# Altium schematic sheet schematic.SchDoc
size A2; SheetNumber: 1; SheetTotal: 1
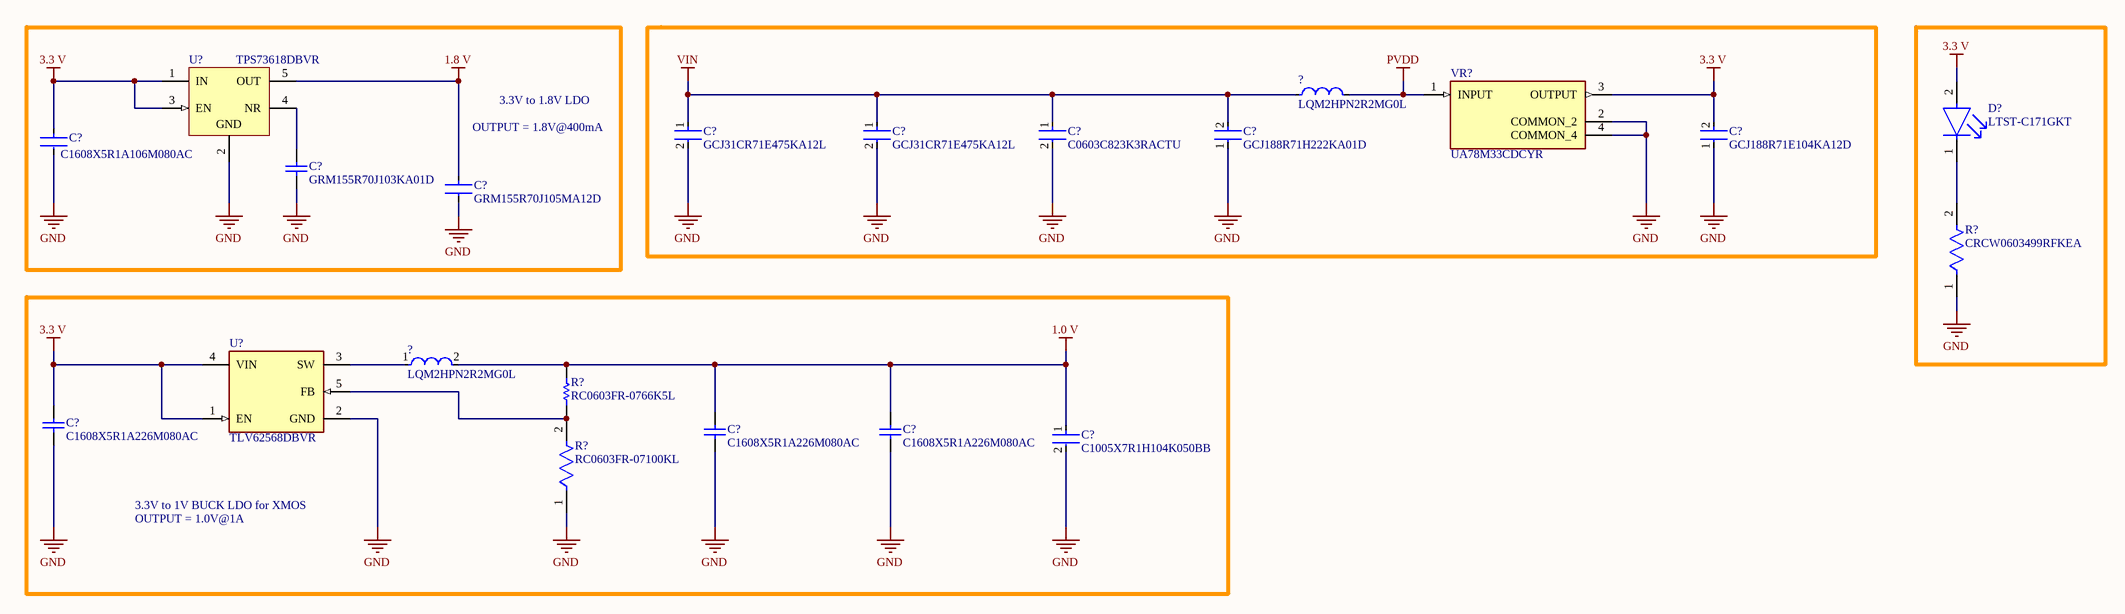
[diagram p0: schematic.SchDoc]

## Parts
(Parts that share a designator on the sheet are numbered #1, #2 ... from top to bottom, then left to right.)
?#1  LQM2HPN2R2MG0L  [FP-LQM2HPN_G0-IPC_B]
?#2  LQM2HPN2R2MG0L  [FP-LQM2HPN_G0-IPC_C]
C?#1  GCJ31CR71E475KA12L  [FP-GCJ31C-0_3-IPC_A]
C?#2  GCJ31CR71E475KA12L  [FP-GCJ31C-0_3-IPC_A]
C?#3  C0603C823K3RACTU  [FP-C0603C-CF-MFG]
C?#4  GCJ188R71H222KA01D  [FP-GCJ188-0_2-IPC_A]
C?#5  GCJ188R71E104KA12D  [FP-GCJ188-0_2-MFG]
C?#6  C1608X5R1A106M080AC  [FP-C1608-080-0_1-IPC_A]
C?#7  GRM155R70J103KA01D  [CAPC1005X55X25ML05T10]
C?#8  GRM155R70J105MA12D  [FP-GRM155-0_05-IPC_C]
C?#9  C1005X7R1H104K050BB  [FP-C1005-050-0_05-IPC_C]
C?#10  C1608X5R1A226M080AC  [CAPC1608X100X20ML10]
C?#11  C1608X5R1A226M080AC  [CAPC1608X100X20ML10]
C?#12  C1608X5R1A226M080AC  [CAPC1608X100X20ML10]
D?  LTST-C171GKT  [FP-LTST-C171GKT-MFG]
R?#1  CRCW0603499RFKEA  [FP-CRCW0603-e3-MFG]
R?#2  RC0603FR-0766K5L  [RESC1608X55X25ML10T15]
R?#3  RC0603FR-07100KL  [FP-RC0603-0_55-MFG]
U?#1  TPS73618DBVR  [DBV0005A_L]
U?#2  TLV62568DBVR  [FP-DBV0005A-MFG]
VR?  UA78M33CDCYR  [VREG_UA78M33CDCYR]

## Nets
1.0 V: ?#2.2 C?#9.1 C?#11.2 C?#12.2 R?#2.2
1.8 V: C?#8.1 U?#1.5(OUT)
3.3 V: C?#5.2 C?#6.2 C?#10.2 D?.2(A) U?#1.1(IN) U?#1.3(EN) U?#2.1(EN) U?#2.4(VIN) VR?.3(OUTPUT)
GND: C?#1.2 C?#2.2 C?#3.2 C?#4.1 C?#5.1 C?#6.1 C?#7.2 C?#8.2 C?#9.2 C?#10.1 C?#11.1 C?#12.1 R?#1.1 R?#3.1 U?#1.2(GND) U?#2.2(GND) VR?.2(COMMON_2) VR?.4(COMMON_4)
PVDD: ?#1.2 VR?.1(INPUT)
VIN: ?#1.1 C?#1.1 C?#2.1 C?#3.1 C?#4.2
Net?#2_1: ?#2.1 U?#2.3(SW)
NetC?#7_1: C?#7.1 U?#1.4(NR)
NetD?_1: D?.1(C) R?#1.2
NetR?#2_1: R?#2.1 R?#3.2 U?#2.5(FB)

## Notes on the sheet
- 3.3V to 1.8V LDO
- (near C?#8) OUTPUT = 1.8V@400mA
- 3.3V to 1V BUCK LDO for XMOS
- OUTPUT = 1.0V@1A

## Library data of the parts
?#1 ?#2 = CMP-1662-00028-2: Multilayer Type Inductor for Power Lines, 1008 (2520), 2.2μH, 20%, 0.1Ω, 1.3A; Core Material: Ferrite; DC Resistance (DCR): 100mR; Inductance: 2.2uH; Test Frequency: 1MHz; Self Resonant Frequency: 40MHz; Shielding: Shielded; Depth: 2.2mm; Length: 2.5mm; Max DC Current: 1.3A; Military Standard: Not; Current Rating: 1.3A; Termination: SMD/SMT; Radiation Hardening: No; Tolerance: 20%; Height: 1.2mm; Case Code (Metric): 2520; DC Current: 1.3A; Inductance Tolerance: 20%; Packaging: Tape and Reel; Width: 2mm; REACH SVHC: No SVHC; Mount: Surface Mount; Max Operating Temperature: 125°C; Lead Free: Lead Free; Case/Package: 1008; Case Code (Imperial): 1008; Series: LQM2HP_G0; Height - Seated (Max): 0.039inch; Package Quantity: 3000; Min Operating Temperature: -55°C
C?#1 C?#2 = CMP-06035-047309-1: Cap Ceramic 4.7uF 25V X7R 10% Pad SMD 1206 Soft Termination  +125°C Automotive T/R; Max Operating Temperature: 125°C; Mount: Surface Mount; Capacitance: 4.7uF; Features: Soft Termination; Thickness: 0.075inch; Dielectric: X7R; Tolerance: 10%; Termination: SMD/SMT; Ratings: AEC-Q200; Length: 0.126inch; Case Code (Imperial): 1206; Voltage Rating (DC): 25V; Lead Free: Lead Free; Case Code (Metric): 3216; Package Quantity: 2000; Min Operating Temperature: -55°C; Case/Package: 1206; Width: 0.063inch; Voltage Rating: 25V; Packaging: Tape and Reel; Depth: 1.6mm
C?#3 = CMP-2006-03280-2: CAP CER 0.082UF 25V 10% X7R 0603; Manufacturer: KEMET; Automotive Grade: Grade 1; Capacitance: 82,000 pF; Value: 82,000 pF; Material: Ceramic; Tolerance: 0.1; Description: C0603 82,000 pF X7R 30ppm/°C 10.00% 25 V; Temperature Coefficient: 30ppm/°C; Voltage Rating: 25 V; Digikey Description: CAP CER 0.082UF 25V 10% X7R 0603; Category: Cap; Device Class L2: Capacitors; Mouser Description: Multilayer Ceramic Capacitors MLCC - SMD/SMT 25volts 82000pF X7R 10%; Device Class L3: Ceramic Capacitors; Octopart: https://octopart.com/c0603c823k3ractu-kemet-9142851; ComponentLink2URL: https://api.kemet.com/component-edge/download/datasheet/C0603C100J5GACAUTO.pdf; Package: C0603C-CF; Temperature Characteristic: X7R; ComponentLink2Description: Datasheet; Lead Free: Yes; Automotive: Yes; Manufacturer Part Number: C0603C823K3RACTU; Temperature Range Low: -55°C; Temperature Range High: +125°C; Height: 0.87mm; RoHS: TRUE; Device Class L1: Passive Components; Temperature: -55°C to +125°C
C?#4 = CMP-2006-02226-2: Cap Ceramic 2200pF 50V X7R 10% Pad SMD 0603 Soft Termination +125°C Automotive T/R; Capacitance: 2.2nF; Voltage Rating (DC): 50V; Thickness: 0.031inch; Case/Package: 0603; Termination: SMD/SMT; Features: Soft Termination; Dielectric: X7R; Packaging: Tape and Reel; Mount: Surface Mount; Height: 0.8mm; Tolerance: 10%; Case Code (Metric): 1608; Case Code (Imperial): 0603; Package Quantity: 1; Depth: 0.8mm; Voltage Rating: 50V; Length: 1.6mm; Width: 0.031inch; Radiation Hardening: No; Max Operating Temperature: 125°C; Min Operating Temperature: -55°C; Ratings: AEC-Q200; Lead Free: Lead Free
C?#5 = CMP-06035-058931-1: Cap Ceramic 0.1uF 25V X7R 10% Pad SMD 0603 Soft Termination +125°C Automotive T/R; Capacitance: 100nF; Tolerance: 10%; Mount: Surface Mount; Features: Soft Termination; Case Code (Imperial): 0603; Voltage Rating: 25V; Min Operating Temperature: -55°C; Case/Package: 0603; Max Operating Temperature: 125°C; Case Code (Metric): 1608; Ratings: AEC-Q200; Packaging: Tape and Reel
C?#6 = CMP-2000-04980-2: Multilayer Ceramic Capacitors 10μF ±20% 10V X5R SMD 0603; Capacitance: 10uF; Min Operating Temperature: -55°C; RoHS Compliant: Yes; Package Quantity: 1; Max Operating Temperature: 85°C; Radiation Hardening: No; Packaging: Tape and Reel; REACH SVHC: No SVHC; Length: 1.6mm; Case/Package: 0603; Series: C; Voltage Rating: 10V; Thickness: 0.035inch; Weight: 7.1E-05oz; Dielectric: X5R; Termination: SMD/SMT; Dielectric Material: Ceramic; Mount: Surface Mount; Construction: Flat; Resistor Type: Ceramic; Tolerance: 20%; Case Code (Metric): 1608; Number of Pins: 2; Case Code (Imperial): 0603; Depth: 0.8mm; Lead Free: Lead Free; Width: 0.031inch; Height: 0.8mm; Voltage Rating (DC): 10V
C?#7 = CMP-2008-03953-1: Manufacturer: Murata; Part Number: GRM155R70J103KA01D
C?#8 = CMP-2008-04588-2: Chip Multilayer Ceramic Capacitors for General Purpose, 0402, 1.0uF, X7R, 15%, 20%, 6.3V; Capacitance: 1uF; Width: 0.02inch; Voltage Rating: 6.3V; REACH SVHC: No SVHC; Mount: Surface Mount; Case Code (Imperial): 0402; Thickness: 0.022inch; Height: 0.5mm; Termination: SMD/SMT; Tolerance: 20%; Packaging: Tape and Reel; Package Quantity: 10000; Weight: 0.000212oz; Case Code (Metric): 1005; Dielectric: X7R; Min Operating Temperature: -55°C; Length: 0.039inch; Voltage Rating (DC): 6.3V; Case/Package: 0402; Max Operating Temperature: 125°C
C?#9 = CMP-2000-05393-2: Multilayer Ceramic Capacitors 100nF ±10% 50V X7R SMD 0402; Voltage: 50V; Dielectric Material: Ceramic; Min Operating Temperature: -55°C; Depth: 0.5mm; Radiation Hardening: No; RoHS Compliant: Yes; Voltage Rating (DC): 50V; Lead Free: Lead Free; Resistor Type: Ceramic; Height: 0.5mm; Dielectric: X7R; Thickness: 0.022inch; Case/Package: 0402; Case Code (Metric): 1005; Termination: SMD/SMT; Capacitance: 100nF; Packaging: Tape and Reel; Max Operating Temperature: 125°C; Mount: Surface Mount; Package Quantity: 1; Width: 0.02inch; Weight: 2.3E-05oz; Voltage Rating: 50V; Tolerance: 10%; Construction: Flat; Case Code (Imperial): 0402; Length: 1mm; REACH SVHC: No SVHC; Series: C
C?#10-C?#12 = CMP-2000-05441-1: Chip Capacitor, 22 uF, +/- 20%, 10 V, -55 to 85 degC, 0603 (1608 Metric), RoHS, Tape and Reel; Manufacturer: TDK; PCN Part Number: MLCCPartNumberChange30/Nov/2012; Voltage - Rated: 10V; Product Training Modules: CSeriesGeneralApplicationsSEAT,CCV,andTVCLDesignToolsGuidetoReplacinganElectrolyticCapacitorwithanMLCC; Other Names: 445-9077-1; Design Resources: 20WNon-IsolatedBuckLEDDriverUsingPLLNK460KG; Online Catalog: CSeries,GeneralPurpose; Capacitance: 22µF; Temperature Coefficient: X5R; Kits: 445-9014-KIT-ND-KITMLCC100PF-22UF060310-50V; Packaging: CutTape(CT); Standard Package: 1; Package / Case: 0603(1608Metric); Lead Style: -; Features: -; Ratings: -; Operating Temperature: -55degC~85degC; Applications: GeneralPurpose; Package Reference: 603; Datasheet URL: http://download.siliconexpert.com/pdfs/2015/4/21/15/54/45/779/tdk_/manual/37024850441143360mlcc_commercial_general_en.pdf; Datasheet Version: Mar-15; Mounting Type: SurfaceMount,MLCC; Lead Spacing: -; Size / Dimension: 0.063"Lx0.031"W(1.60mmx0.80mm); Height - Seated (Max): -; Package Description: 2-Pin Surface Mount Device, Body 1.6 x 0.8 mm; Manufacturer URL: http://www.tdk.com/; RoHS Information: RoHSCertificate-MLCC; Tolerance: ±20%; Series: C; Thickness (Max): 0.035"(0.90mm); Family: CeramicCapacitors; Category: Capacitors
D? = CMP-22017-000007-1: LED GREEN CLEAR CHIP SMD; Luminous Intensity: 12mcd; Lens Color: Colorless; Dominant Wavelength: 569nm; Number of LEDs: 1; Power Dissipation: 100mW; Viewing Angle: 130°; Reverse Voltage: 5V; Test Current: 10mA; Forward Voltage: 2.1V; Wavelength: 585nm; Lens Style: Diffused; Forward Current: 30mA; Height: 0.8mm; Mount: Surface Mount; Package Quantity: 1; Length: 2mm; Case Code (Metric): 2012; Number of Pins: 2; Number of Elements: 1; Packaging: Tape and Reel; Color: Green; Min Operating Temperature: -55°C; Case/Package: 0805; Power Rating: 100mW; Max Operating Temperature: 85°C; Radiation Hardening: No; Depth: 1.25mm; Lens Transparency: Clear; Width: 1.25mm; Lead Free: Lead Free; Case Code (Imperial): 0805; Illumination Color: Green
R?#1 = CMP-2000-03390-2: RES Thick Film, 499Ω, 1%, 0.1W, 100ppm/°C, 0603; Voltage Rating (DC): 75V; Power Rating: 100mW; Resistance: 499R; Case/Package: 0603; Package Quantity: 5000; Military Standard: Not; Length: 1.55mm; Width: 0.85mm; Number of Terminations: 2; Lead Free: Lead Free; Height: 0.45mm; Weight: 7.1E-05oz; Composition: Thick Film; Radiation Hardening: No; Max Operating Temperature: 155°C; Tolerance: 1%; Working Voltage: 75V; Temperature Coefficient: 100ppm/°C; Packaging: Tape and Reel; Contact Plating: Tin; Termination: SMD/SMT; Depth: 0.85mm; Case Code (Metric): 1608; Min Operating Temperature: -55°C; Mount: Surface Mount; Case Code (Imperial): 0603; Voltage Rating: 75V
R?#2 = CMP-2000-04110-1: Manufacturer: Yageo; Part Number: RC0603FR-0766K5L
R?#3 = CMP-2100-03662-2: RES SMD 100K OHM 1% 1/10W 0603; Voltage Rating (DC): 50V; Resistance: 100kR; Max Power Dissipation: 100mW; Temperature Coefficient: 100ppm/°C; Working Voltage: 75V; Length: 1.6mm; Lead Free: Lead Free; Number of Terminations: 2; Packaging: Tape and Reel; Voltage Rating: 50V; Termination: SMD/SMT; Width: 0.8mm; Resistor Type: Thick Film; Resistance Tolerance: 1%; Features: Moisture Resistant; Height: 0.45mm; Construction: Rectangular; Case/Package: 0603; Military Standard: Not; Case Code (Imperial): 0603; Series: RC; Technology: THICK FILM; Depth: 0.8mm; RoHS Compliant: Yes; REACH SVHC: No SVHC; Min Operating Temperature: -55°C; Case Code (Metric): 1608; Max Operating Temperature: 155°C; Power Rating: 100mW; Number of Pins: 2; Tolerance: 1%
U?#1 = CMP-0395-00289-2: Single Output Low Noise LDO, 400 mA, Fixed 1.8 V Output, 1.7 to 5.5 V Input, with Reverse Current Protection, 5-pin SOT-23 (DBV), -40 to 85 degC, Green (RoHS & no Sb/Br); Manufacturer: Texas Instruments; Iout(Max)(A): 0.4; Vdo(Typ)(mV): 75; SubFamily: Single Channel LDO; Fixed Output Options(V): 1.8; Vin(Min)(V): 1.7; Rating: Catalog; Iq(Typ)(mA): 0.3; Accuracy(%): 1; Vin(Max)(V): 5.5; ComponentLink1URL: http://www.ti.com/; ComponentLink4URL: Samples URL:http://www.ti.com/product/tps73618#samples; Mounting Technology: Surface Mount; ComponentLink3Description: Package Specification; ComponentLink1Description: Manufacturer URL; ComponentLink2URL: http://www.ti.com/general/docs/lit/getliterature.tsp?genericPartNumber=TPS73618&fileType=pdf; ComponentLink3URL: http://www.ti.com/litv/pdf/mpds018i; PackageReference: DBV0005A; Vout Adj(Max)(V): 1.8; DatasheetVersion: SBVS038T; Vout Adj(Min)(V): 1.8; PackageVersion: 4073253-4/K; ComponentLink2Description: Datasheet; Code_JEDEC: MO-178; ComponentLink4Description: URL Link1; Eco-Plan: Green (RoHS & no Sb/Br); PartNumber: TPS73618DBVR; PackageDescription: 5-Pin Plastic Small Outline, Body 1.60 Ãƒâ€” 2.90 mm, Pitch 0.95 mm
U?#2 = CMP-04918-000009-1: IC REG BUCK ADJ 1A SOT23-5; Manufacturer: Texas Instruments; Number Of Outputs: 1; Max Supply Voltage: 5.5V; Nominal Supply Current: 35uA; Standoff Height: 0mm; Max Junction Temp: +125°C; Output Voltage: 0.6-5.5V; Max Duty Cycle: 100%; Description: Buck Switching Regulator IC Positive Adjustable 0.6V 1 Output 1A SC-74A, SOT-753; Output Type: AdjustableProgrammable; Min Supply Voltage: 2.5V; Switching Frequency: 1.5MHz; Height: 1.45mm; Mouser Description: 1-A High Efficiency Synchronous Buck Converter, SMD, 5-pin SOT-23, T/R 3k; Temperature Range High: +125°C; Manufacturer Part Number: TLV62568DBVR; Switching Topology: Buck; ComponentLink2Description: Datasheet; Digikey Description: IC REG BUCK ADJ 1A SOT23-5; Octopart: https://octopart.com/tlv62568dbvr-texas+instruments-76926199; Category: IC; Device Class L1: Integrated Circuits (ICs); RoHS: TRUE; ComponentLink2URL: http://www.ti.com/lit/ds/symlink/tlv62568.pdf; Lead Free: Yes; Package: DBV0005A; Automotive: No; Device Class L2: Power Management ICs; Temperature: -40°C to +125°C; Temperature Range Low: -40°C; Device Class L3: Voltage Regulators - Switching; Output Current: 1A
VR? = UA78M33CDCYR: 500-mA, 30-V, linear voltage regulator; MF: Texas Instruments; Purchase-URL: https://pricing.snapeda.com/search/part/UA78M33CDCYR/?ref=eda; Package: SOT-223-4 Texas Instruments; Value: *; Check_prices: https://www.snapeda.com/parts/UA78M33CDCYR/Texas+Instruments/view-part/?ref=eda; SnapEDA_Link: https://www.snapeda.com/parts/UA78M33CDCYR/Texas+Instruments/view-part/?ref=snap; Availability: In Stock; Price: None; MP: UA78M33CDCYR